# Altium schematic sheet Mosquito3.SchDoc
size A4
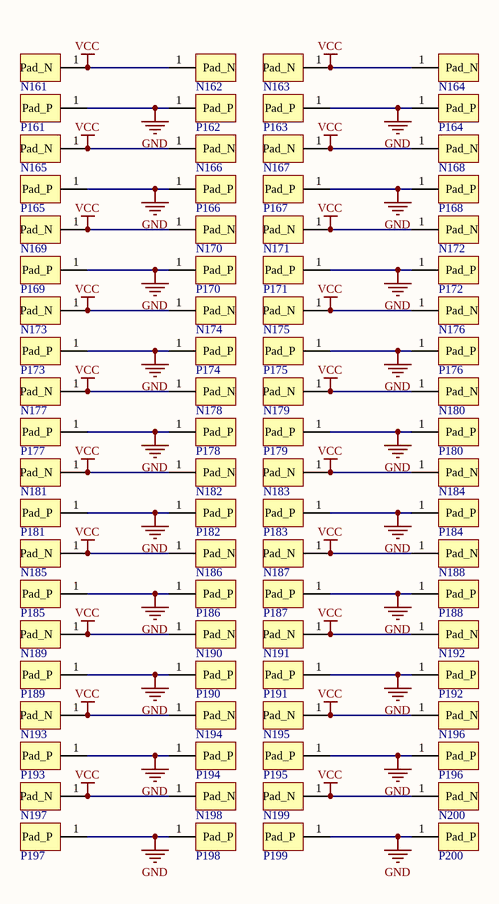
[diagram p0: Mosquito3.SchDoc]

## Parts
N161  Pad_N  [Pad]  (value not drawn)
N162  Pad_N  [Pad]  (value not drawn)
N163  Pad_N  [Pad]  (value not drawn)
N164  Pad_N  [Pad]  (value not drawn)
N165  Pad_N  [Pad]  (value not drawn)
N166  Pad_N  [Pad]  (value not drawn)
N167  Pad_N  [Pad]  (value not drawn)
N168  Pad_N  [Pad]  (value not drawn)
N169  Pad_N  [Pad]  (value not drawn)
N170  Pad_N  [Pad]  (value not drawn)
N171  Pad_N  [Pad]  (value not drawn)
N172  Pad_N  [Pad]  (value not drawn)
N173  Pad_N  [Pad]  (value not drawn)
N174  Pad_N  [Pad]  (value not drawn)
N175  Pad_N  [Pad]  (value not drawn)
N176  Pad_N  [Pad]  (value not drawn)
N177  Pad_N  [Pad]  (value not drawn)
N178  Pad_N  [Pad]  (value not drawn)
N179  Pad_N  [Pad]  (value not drawn)
N180  Pad_N  [Pad]  (value not drawn)
N181  Pad_N  [Pad]  (value not drawn)
N182  Pad_N  [Pad]  (value not drawn)
N183  Pad_N  [Pad]  (value not drawn)
N184  Pad_N  [Pad]  (value not drawn)
N185  Pad_N  [Pad]  (value not drawn)
N186  Pad_N  [Pad]  (value not drawn)
N187  Pad_N  [Pad]  (value not drawn)
N188  Pad_N  [Pad]  (value not drawn)
N189  Pad_N  [Pad]  (value not drawn)
N190  Pad_N  [Pad]  (value not drawn)
N191  Pad_N  [Pad]  (value not drawn)
N192  Pad_N  [Pad]  (value not drawn)
N193  Pad_N  [Pad]  (value not drawn)
N194  Pad_N  [Pad]  (value not drawn)
N195  Pad_N  [Pad]  (value not drawn)
N196  Pad_N  [Pad]  (value not drawn)
N197  Pad_N  [Pad]  (value not drawn)
N198  Pad_N  [Pad]  (value not drawn)
N199  Pad_N  [Pad]  (value not drawn)
N200  Pad_N  [Pad]  (value not drawn)
P161  Pad_P  [Pad]  (value not drawn)
P162  Pad_P  [Pad]  (value not drawn)
P163  Pad_P  [Pad]  (value not drawn)
P164  Pad_P  [Pad]  (value not drawn)
P165  Pad_P  [Pad]  (value not drawn)
P166  Pad_P  [Pad]  (value not drawn)
P167  Pad_P  [Pad]  (value not drawn)
P168  Pad_P  [Pad]  (value not drawn)
P169  Pad_P  [Pad]  (value not drawn)
P170  Pad_P  [Pad]  (value not drawn)
P171  Pad_P  [Pad]  (value not drawn)
P172  Pad_P  [Pad]  (value not drawn)
P173  Pad_P  [Pad]  (value not drawn)
P174  Pad_P  [Pad]  (value not drawn)
P175  Pad_P  [Pad]  (value not drawn)
P176  Pad_P  [Pad]  (value not drawn)
P177  Pad_P  [Pad]  (value not drawn)
P178  Pad_P  [Pad]  (value not drawn)
P179  Pad_P  [Pad]  (value not drawn)
P180  Pad_P  [Pad]  (value not drawn)
P181  Pad_P  [Pad]  (value not drawn)
P182  Pad_P  [Pad]  (value not drawn)
P183  Pad_P  [Pad]  (value not drawn)
P184  Pad_P  [Pad]  (value not drawn)
P185  Pad_P  [Pad]  (value not drawn)
P186  Pad_P  [Pad]  (value not drawn)
P187  Pad_P  [Pad]  (value not drawn)
P188  Pad_P  [Pad]  (value not drawn)
P189  Pad_P  [Pad]  (value not drawn)
P190  Pad_P  [Pad]  (value not drawn)
P191  Pad_P  [Pad]  (value not drawn)
P192  Pad_P  [Pad]  (value not drawn)
P193  Pad_P  [Pad]  (value not drawn)
P194  Pad_P  [Pad]  (value not drawn)
P195  Pad_P  [Pad]  (value not drawn)
P196  Pad_P  [Pad]  (value not drawn)
P197  Pad_P  [Pad]  (value not drawn)
P198  Pad_P  [Pad]  (value not drawn)
P199  Pad_P  [Pad]  (value not drawn)
P200  Pad_P  [Pad]  (value not drawn)

## Nets
GND: P161.1(Pad_P) P162.1(Pad_P) P163.1(Pad_P) P164.1(Pad_P) P165.1(Pad_P) P166.1(Pad_P) P167.1(Pad_P) P168.1(Pad_P) P169.1(Pad_P) P170.1(Pad_P) P171.1(Pad_P) P172.1(Pad_P) P173.1(Pad_P) P174.1(Pad_P) P175.1(Pad_P) P176.1(Pad_P) P177.1(Pad_P) P178.1(Pad_P) P179.1(Pad_P) P180.1(Pad_P) P181.1(Pad_P) P182.1(Pad_P) P183.1(Pad_P) P184.1(Pad_P) P185.1(Pad_P) P186.1(Pad_P) P187.1(Pad_P) P188.1(Pad_P) P189.1(Pad_P) P190.1(Pad_P) P191.1(Pad_P) P192.1(Pad_P) P193.1(Pad_P) P194.1(Pad_P) P195.1(Pad_P) P196.1(Pad_P) P197.1(Pad_P) P198.1(Pad_P) P199.1(Pad_P) P200.1(Pad_P)
VCC: N161.1(Pad_N) N162.1(Pad_N) N163.1(Pad_N) N164.1(Pad_N) N165.1(Pad_N) N166.1(Pad_N) N167.1(Pad_N) N168.1(Pad_N) N169.1(Pad_N) N170.1(Pad_N) N171.1(Pad_N) N172.1(Pad_N) N173.1(Pad_N) N174.1(Pad_N) N175.1(Pad_N) N176.1(Pad_N) N177.1(Pad_N) N178.1(Pad_N) N179.1(Pad_N) N180.1(Pad_N) N181.1(Pad_N) N182.1(Pad_N) N183.1(Pad_N) N184.1(Pad_N) N185.1(Pad_N) N186.1(Pad_N) N187.1(Pad_N) N188.1(Pad_N) N189.1(Pad_N) N190.1(Pad_N) N191.1(Pad_N) N192.1(Pad_N) N193.1(Pad_N) N194.1(Pad_N) N195.1(Pad_N) N196.1(Pad_N) N197.1(Pad_N) N198.1(Pad_N) N199.1(Pad_N) N200.1(Pad_N)